# EAGLE schematic driver_L9958SB (EAGLE 7.6.0)
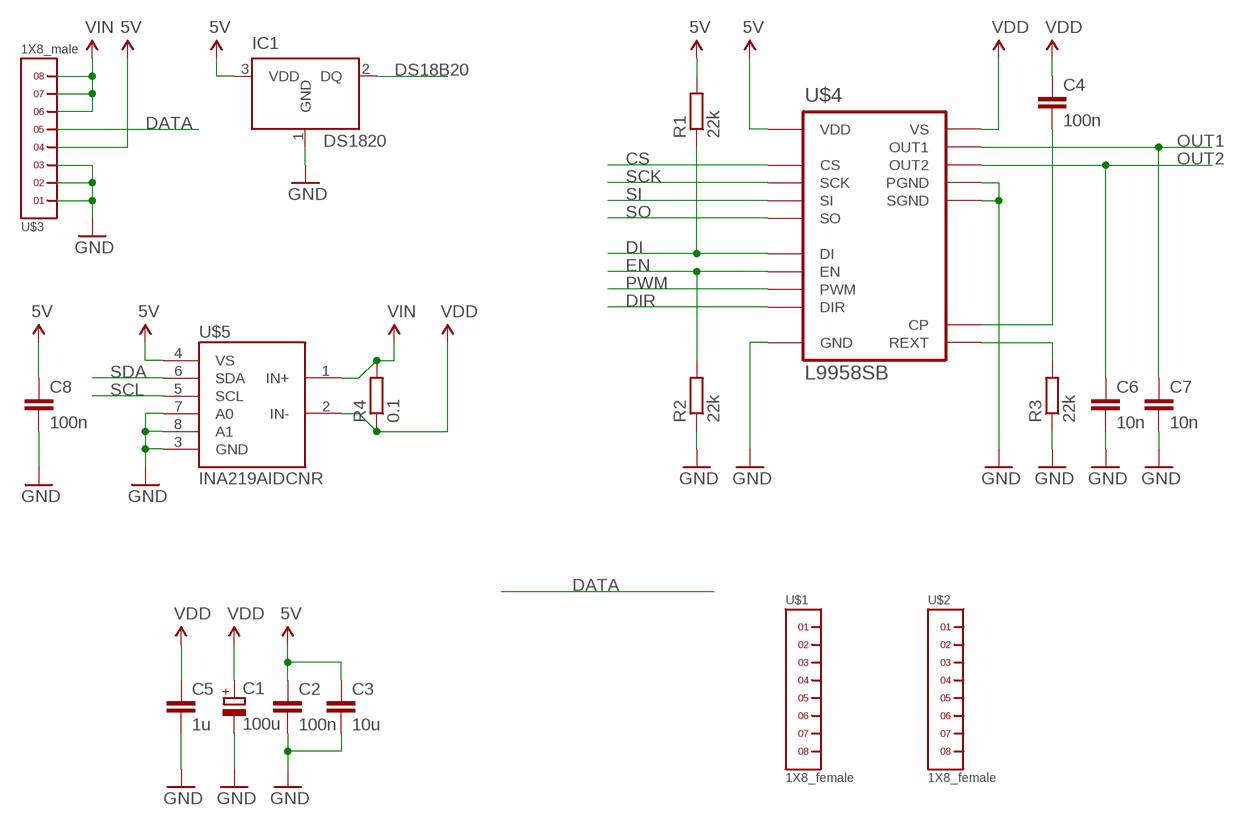
[diagram p0: schematic, sheet 1]

## Parts
C1  100u  CPOL-EUD  [PANASONIC_D]
C2  100n  C-EUC0402K  [C0402K]
C3  10u  C-EUC0603K  [C0603K]
C4  100n  C-EUC0402K  [C0402K]
C5  1u  C-EUC0402K  [C0402K]
C6  10n  C-EUC0402K  [C0402K]
C7  10n  C-EUC0402K  [C0402K]
C8  100n  C-EUC0402K  [C0402K]
IC1  DS1820  [TO-92]
R1  22k  R-EU_R0402  [R0402]
R2  22k  R-EU_R0402  [R0402]
R3  22k  R-EU_R0402  [R0402]
R4  0.1  R-EU_R0603  [R0603]
U$1  1X8_female  1X8  [1X8]
U$2  1X8_female  1X8  [1X8]
U$3  1X8_male  1X8MALE  [1X8_MALE]
U$4  L9958SB  [POWERSO16]
U$5  INA219AIDCNR  [SOT23-8L]

## Nets
5V: C2.1 C3.1 C8.1 IC1.3(VDD) R1.2 U$3.4 U$4.P$16(VDD) U$5.4(VS)
CS: U$4.P$3(CS)
DATA: U$3.5
DI: R1.1 U$4.P$7(DI)
DIR: U$4.P$5(DIR)
DS18B20: IC1.2(DQ)
EN: R2.2 U$4.P$9(EN)
GND: C1.- C2.2 C3.2 C5.2 C6.2 C7.2 C8.2 IC1.1(GND) R2.1 R3.1 U$3.1 U$3.2 U$3.3 U$4.P$1(GND) U$4.P$8(PGND) U$4.P$17(SGND) U$5.3(GND) U$5.7(A0) U$5.8(A1)
N$3: C4.2 U$4.P$4(CP)
N$4: R3.2 U$4.P$12(REXT)
OUT1: C7.1 U$4.P$6(OUT1)
OUT2: C6.1 U$4.P$10(OUT2)
PWM: U$4.P$11(PWM)
SCK: U$4.P$15(SCK)
SCL: U$5.5(SCL)
SDA: U$5.6(SDA)
SI: U$4.P$14(SI)
SO: U$4.P$2(SO)
VDD: C1.+ C4.1 C5.1 R4.1 U$4.P$13(VS) U$5.2(IN-)
VIN: R4.2 U$3.6 U$3.7 U$3.8 U$5.1(IN+)
Unconnected: U$1.1 U$1.2 U$1.3 U$1.4 U$1.5 U$1.6 U$1.7 U$1.8 U$2.1 U$2.2 U$2.3 U$2.4 U$2.5 U$2.6 U$2.7 U$2.8

## Library data of the parts
C1 = rcl:CPOL-EU: POLARIZED CAPACITOR, European symbol
C2-C8 = rcl:C-EU: CAPACITOR, European symbol
IC1 = DS1820:DS1820: DS1820 - 1-Wire Digital Thermometer
R1-R4 = rcl:R-EU_: RESISTOR, European symbol
U$1-U$3 = headers(.05in):1X8
U$4 = L9958SB:L9958SB
U$5 = INA219AIDCNR:INA219AIDCNR